# EAGLE design x-OSC Programmer (EAGLE 6.4)
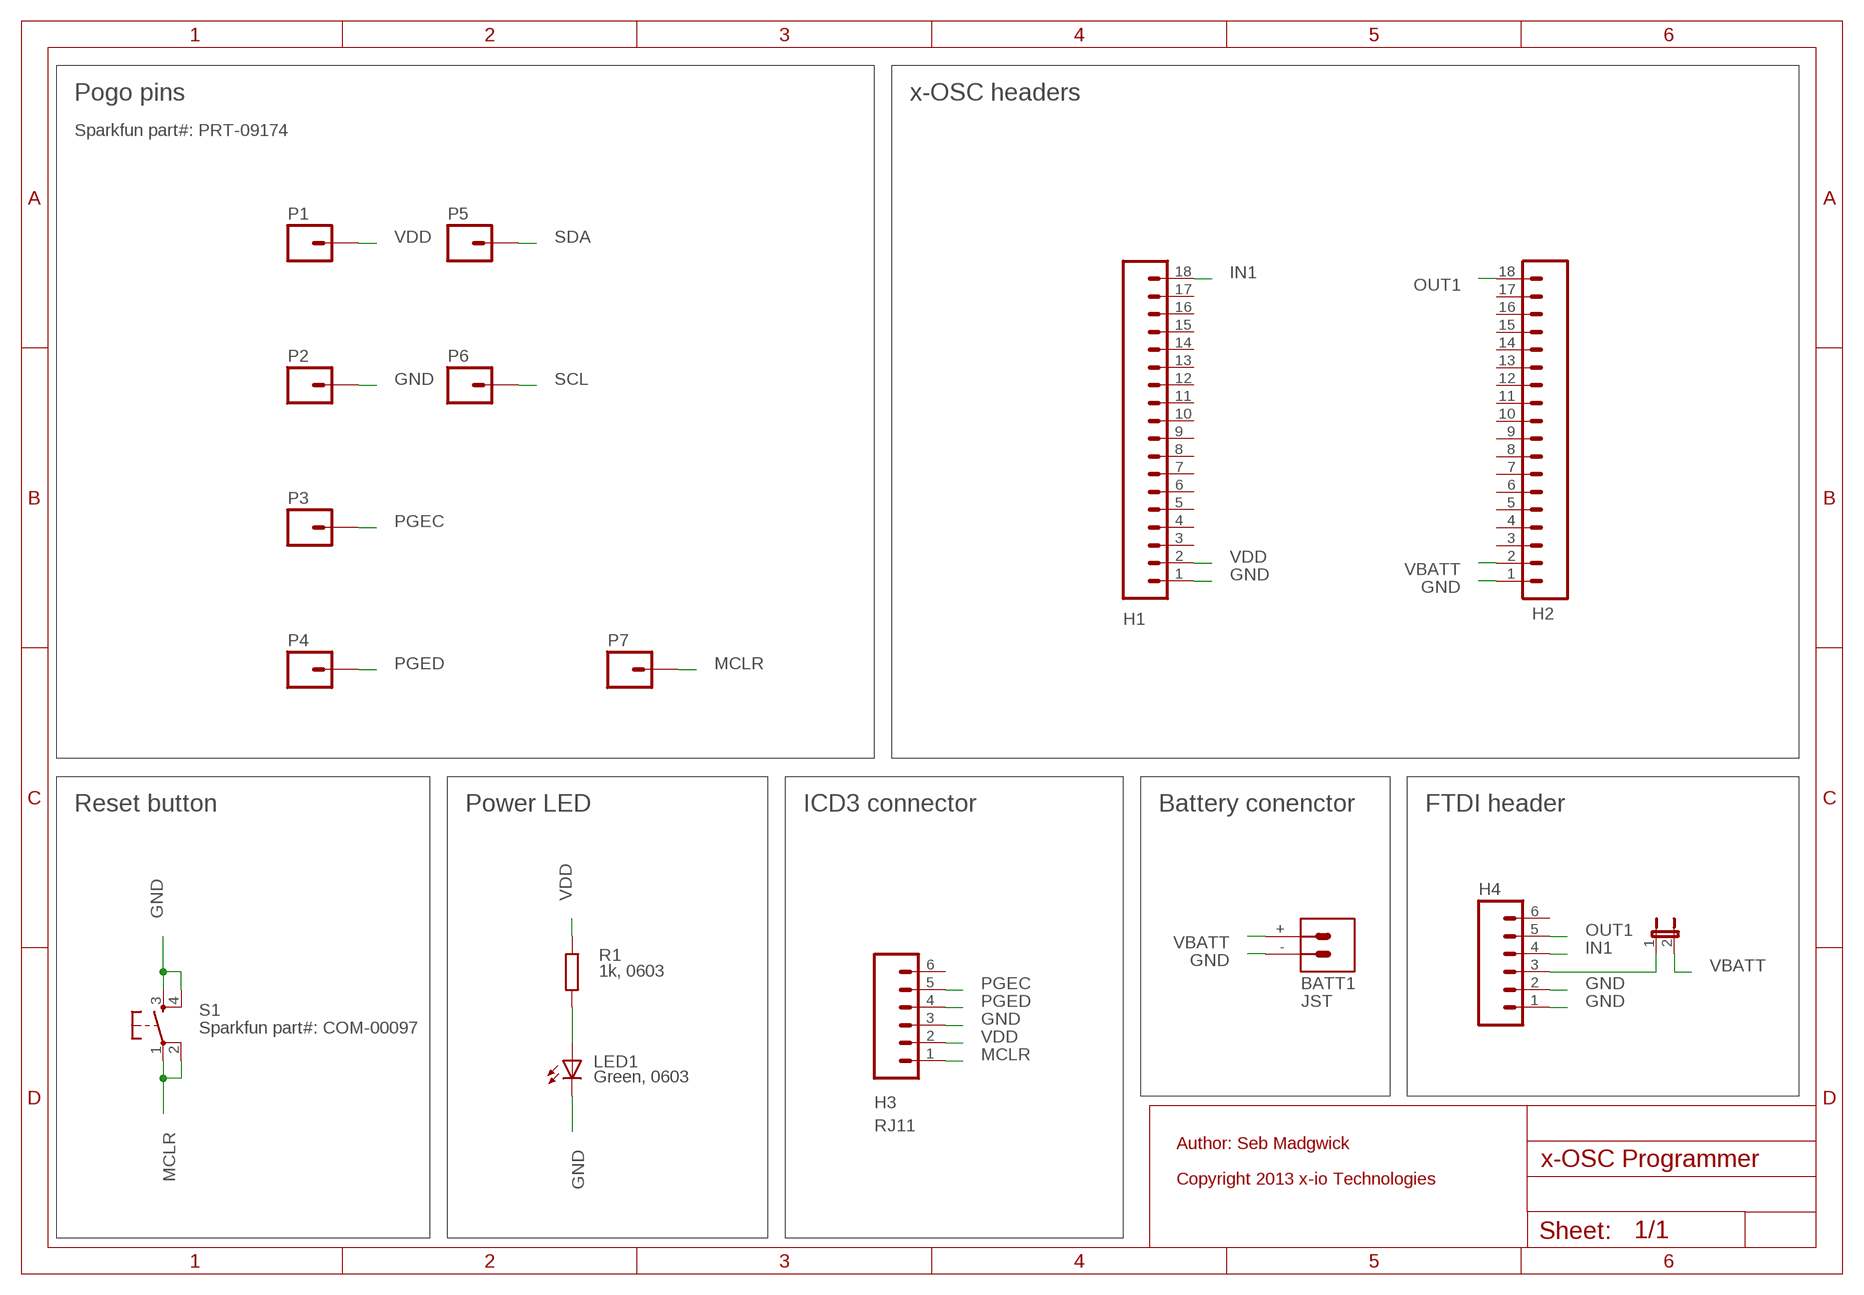
[diagram p0: schematic, sheet 1]

## Parts
BATT1  JST  [JST-R/A]
H1  M18_  [1X18]
H2  M18_  [1X18]
H3  RJ11  RJ11-6PTH  [RJ11-6]
H4  M06SIP  [1X06]
JP1  JUMPER-2SMD-NO  [SJ_2S-NO]
LED1  Green, 0603  LED0603  [LED-0603]
P1  M01PTH  [1X01]
P2  M01PTH  [1X01]
P3  M01PTH  [1X01]
P4  M01PTH  [1X01]
P5  M01PTH  [1X01]
P6  M01PTH  [1X01]
P7  M01PTH  [1X01]
R1  1k, 0603  R-EU_R0402  [R0402]
S1  Sparkfun part#: COM-00097  TAC_SWITCHPTH  [TACTILE-PTH]

## Nets
GND: BATT1.- H1.1 H2.1 H3.3 H4.1 H4.2 LED1.C P2.1 S1.3 S1.4
IN1: H1.18 H4.4
MCLR: H3.1 P7.1 S1.1 S1.2
N$1: LED1.A R1.2
N$2: H4.3 JP1.1
OUT1: H2.18 H4.5
PGEC: H3.5 P3.1
PGED: H3.4 P4.1
SCL: P6.1
SDA: P5.1
VBATT: BATT1.+ H2.2 JP1.2
VDD: H1.2 H3.2 P1.1 R1.1
Unconnected: H1.3 H1.4 H1.5 H1.6 H1.7 H1.8 H1.9 H1.10 H1.11 H1.12 H1.13 H1.14 H1.15 H1.16 H1.17 H2.3 H2.4 H2.5 H2.6 H2.7 H2.8 H2.9 H2.10 H2.11 H2.12 H2.13 H2.14 H2.15 H2.16 H2.17 H3.6 H4.6

## Notes on the sheet
- Pogo pins | x-OSC headers
- Sparkfun part#: PRT-09174
- Reset button | Power LED | ICD3 connector | Battery conenctor | FTDI header
- Author: Seb Madgwick
- Copyright 2013 x-io Technologies

## Library data of the parts
BATT1 = x-io:JST
H1 H2 = SparkFun:M18
H3 = SparkFun:RJ11-6: RJ11 Jack Simple 6 pin RJ11 jack. Commonly found on CAT3 devices and Microchip programmers. SKU: PRT-00132
H4 = SparkFun:M06: Header 6 Standard 6-pin 0.1" header. Use with straight break away headers (SKU : PRT-00116), right angle break away headers (PRT-00553), swiss pins (PRT-00743), machine pins (PRT-00117), and female headers (PRT-00115). Molex polarized connector foot print use with SKU : PRT-08094 with associated crimp pins and housings. NOTES ON THE VARIANTS LOCK and LOCK_LONGPADS... This footprint was designed to help hold the alignment of a through-hole component (i.e. 6-pin header) while soldering it into place. You may notice that each hole has been shifted either up or down by 0.005 of an inch from it's more standard position (which is a perfectly straight line). This slight alteration caused the pins (the squares in the middle) to touch the edges of the holes. Because they are alternating, it causes a "brace" to hold the component in place. 0.005 has proven to be the perfect amount of "off-center" position when using our standard breakaway headers. Although looks a little odd when you look at the bare footprint, once you have a header in there, the alteration is very hard to notice. Also, if you push a header all the way into place, it is covered up entirely on the bottom side. This idea of altering the position of holes to aid alignment will be further integrated into the Sparkfun Library for other footprints. It can help hold any component with 3 or more connection pins.
JP1 = SparkFun:JUMPER-2: Jumper Basic 0.1" spaced jumper. Use with breakaway headers.
LED1 = SparkFun:LED: LEDs Standard schematic elements and footprints for 5mm, 3mm, 1206, and 0603 sized LEDs. 5mm - Spark Fun Electronics SKU : COM-00529 (and others)
P1-P7 = SparkFun:M01: Header 1 Standard 1-pin 0.1" header. Use with straight break away headers (SKU : PRT-00116), right angle break away headers (PRT-00553), swiss pins (PRT-00743), machine pins (PRT-00117), and female headers (PRT-00115).
R1 = rcl:R-EU_: RESISTOR, European symbol
S1 = SparkFun:TAC_SWITCH: Momentary Switch Button commonly used for reset or general input. Spark Fun Electronics SKU : COM-00097

## Board
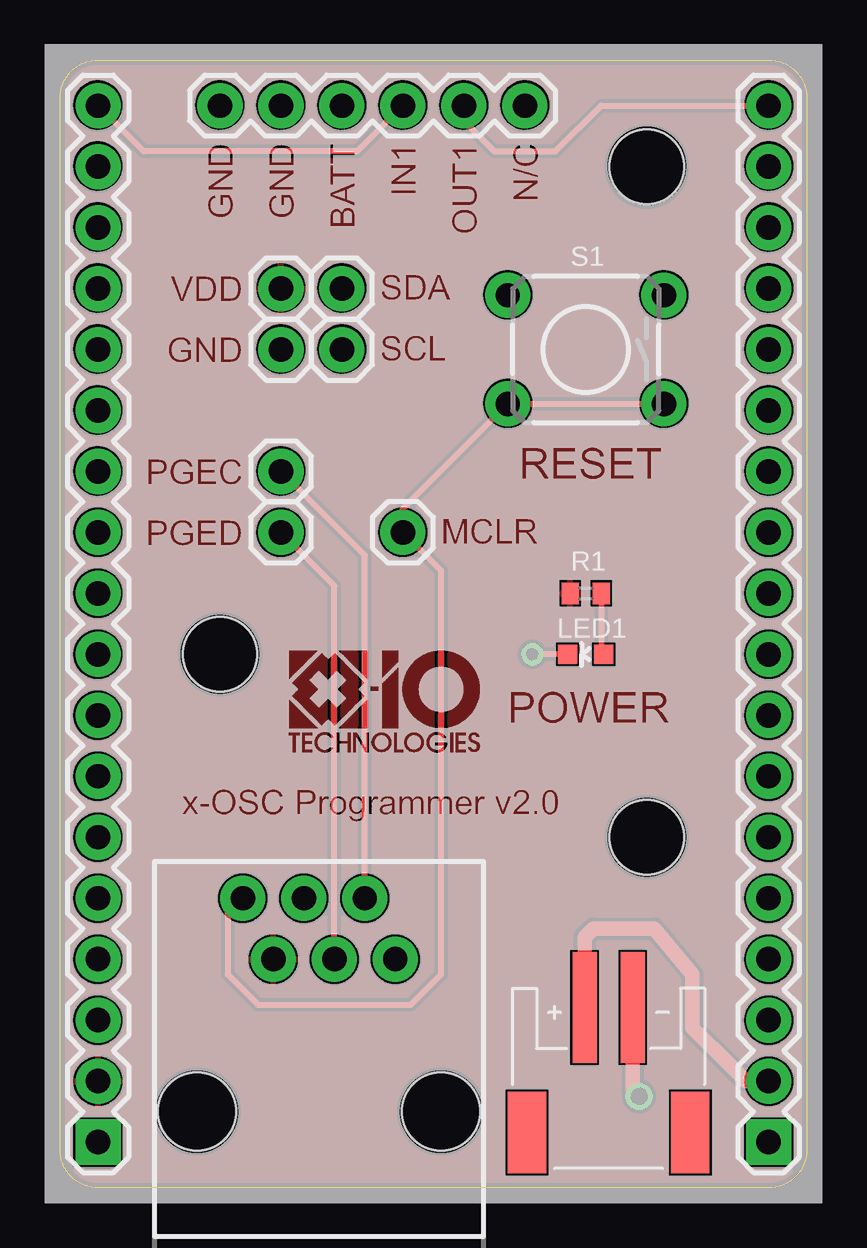
[diagram p1: board, top side]
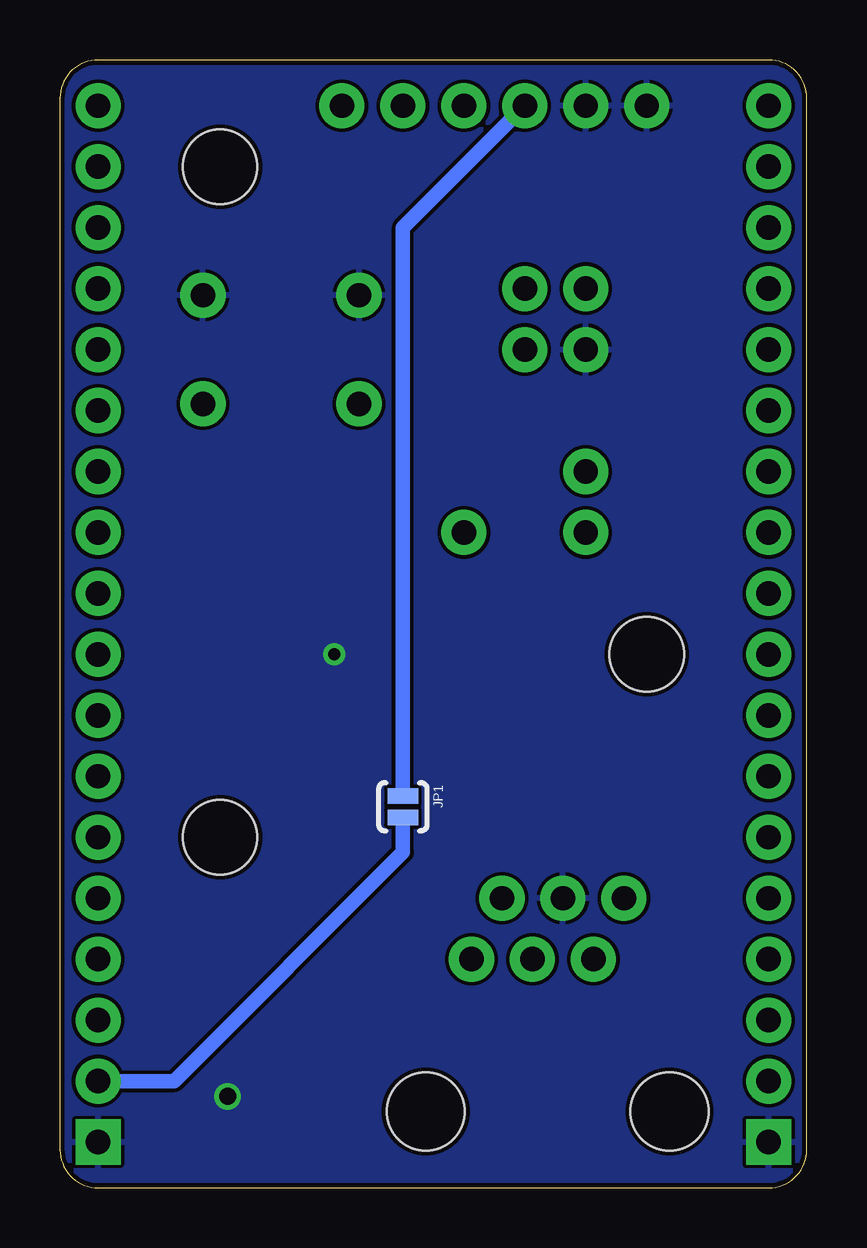
[diagram p2: board, bottom side, seen from below]

Size 31.11 x 46.99 mm. Coordinates in mm from the lower left corner, seen from the top.
Outline: 0,45.4 arc-90 1.59,46.99 29.53,46.99 arc-90 31.11,45.4 31.11,1.59 arc-90 29.53,0 1.59,0 arc-90 0,1.59 0,45.4
Copper layers (1*16): Top 0.035mm / dielectric 1.5mm / Bottom 0.035mm
Design rules "default *": minimum track width 0.15mm, minimum drill 0.3mm, track to track 0.15mm, track to pad 0.15mm, pad to pad 0.15mm, via to via 0.15mm, smd to smd 0.15mm, copper to edge 0.2mm, drill to drill 0.15mm, minimum pad ring 10mil, minimum via ring 8mil, stop-mask expansion 4mil, vias tented up to drill 1mm, thermal gap 0.15mm
Holes 3.1 mm at 6.67,22.23 24.45,42.55 24.45,14.61

### Footprints (pad centres in the part's own frame; a part is rotated, then mirrored left to right if it is on the bottom)
JST-R/A = smd 1 x 4.6: + 1,-3.7; - -1,-3.7 | smd 1.6 x 3.4: NC1 -3.4,1.5; NC2 3.4,1.5
1X18 = drill 1.016 pad 1.88 square: 1 0,0 | drill 1.016 pad 1.88: 2 2.54,0; 3 5.08,0; 4 7.62,0; 5 10.16,0; 6 12.7,0; 7 15.24,0; 8 17.78,0; 9 20.32,0; 10 22.86,0; 11 25.4,0; 12 27.94,0; 13 30.48,0; 14 33.02,0; 15 35.56,0; 16 38.1,0; 17 40.64,0; 18 43.18,0
RJ11-6 = drill 1.016 pad 1.88: 1 1.905,8.89; 2 3.175,6.35; 3 4.445,8.89; 4 5.715,6.35; 5 6.985,8.89; 6 8.255,6.35 | hole 3.251: 0,0; 10.16,0
1X06 = drill 1.016 pad 1.88: 1 0,0; 2 2.54,0; 3 5.08,0; 4 7.62,0; 5 10.16,0; 6 12.7,0
SJ_2S-NO = smd 0.635 x 1.27: 1 -0.45,0; 2 0.45,0
LED-0603 = smd 0.8 x 0.8: A 0,-0.75; C 0,0.75
1X01 = drill 1.016 pad 1.88: 1 0,0
R0402 = smd 0.7 x 0.9: 1 -0.65,0; 2 0.65,0
TACTILE-PTH = drill 1.016 pad 1.88: 1 -3.251,2.261; 2 3.251,2.261; 3 -3.251,-2.261; 4 3.251,-2.261

### Placement (x,y rotation side)
BATT1  22.86,3.81 180 top
H1  1.59,1.91 90 top
H2  29.53,1.91 90 top
H3  5.71,3.17 0 top
H4  6.67,45.09 0 top
JP1  16.83,15.88 270 bottom
LED1  21.91,22.23 90 top
P1  9.21,37.47 0 top
P2  9.21,34.92 0 top
P3  9.21,29.84 0 top
P4  9.21,27.3 0 top
P5  11.75,37.47 0 top
P6  11.75,34.92 0 top
P7  14.29,27.3 0 top
R1  21.91,24.77 0 top
S1  21.91,34.92 180 top
U$1  [X-IO_TECHNOLOGIES_LOGO_8MM_TOP]  9.53,18.1 0 top
U$2  [X-OSC_PROGRAMMER_V2.0_SILKSCREEN]  -0.64,-0.64 0 top

### Tracks (layer width: path | path; a pad name or v marks a point on that pad's centre or on a via)
GND  (via drill 0.5, 0.7)
  Top 0.254: LED1.C v19.68,22.23
  Top 0.61: BATT1.- 23.86,4.08 v24.13,3.81
  pour Bottom: 0,0 31.11,0 31.11,46.99 0,46.99
IN1
  Top 0.254: H4.4 12.38,43.18 3.49,43.18 H1.18
MCLR
  Top 0.254: H3.1 6.99,11.43 6.99,8.89 8.26,7.62 14.61,7.62 15.88,8.89 15.88,9.21 15.88,25.72 P7.1 14.29,28.3 S1.2 S1.1
N$1
  Top 0.254: R1.2 22.56,22.32 LED1.A
N$2
  Bottom 0.61: JP1.1 16.83,40.01 H4.3
OUT1
  Top 0.254: H4.5 16.83,44.45 18.1,43.18 20.64,43.18 22.54,45.09 H2.18
PGEC
  Top 0.254: H3.5 12.7,26.35 P3.1
PGED
  Top 0.254: H3.4 11.43,25.08 P4.1
VBATT
  Top 0.61: BATT1.+ 21.86,10.43 22.23,10.79 24.77,10.79 26.35,8.89 26.35,6.67 27.94,5.08 28.57,4.45 H2.2
  Bottom 0.61: H2.2 26.35,4.45 16.83,13.97 JP1.2
VDD
  pour Top: 0,0 31.11,0 31.11,46.99 0,46.99

### Text on the board
_tsilk: GND | GND | BATT | IN1 | OUT1 | N/C | VDD | SDA | GND | SCL | RESET | PGEC | PGED | MCLR | POWER | x-OSC Programmer v2.0